# EAGLE design cutdownboard (EAGLE 6.4)
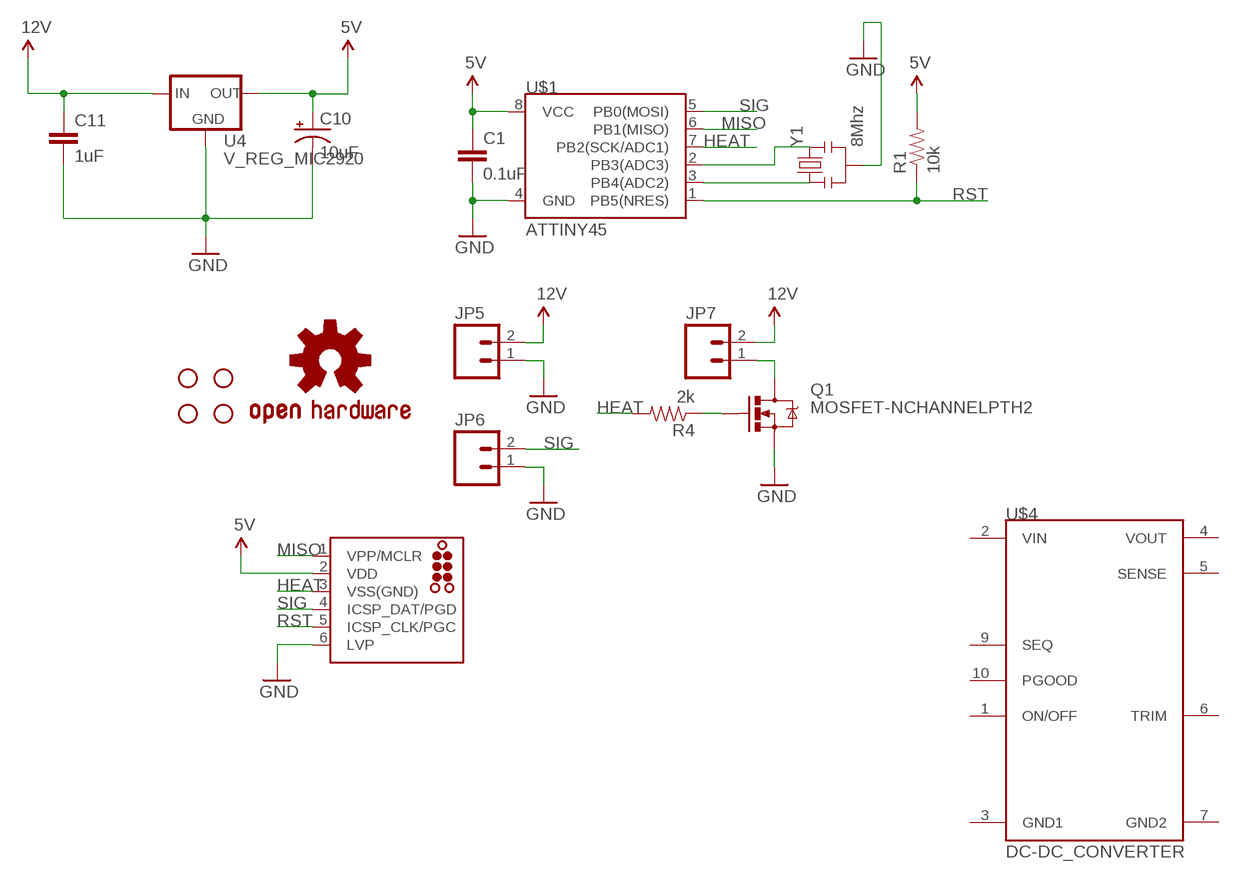
[diagram p0: schematic, sheet 1]

## Parts
C1  0.1uF  C-EUC0603  [C0603]
C10  10uF  CAP_POL1206  [EIA3216]
C11  1uF  C-EUC0603  [C0603]
J1  TC2030-MCP  [TC2030-MCP]
JP1  STAND-OFF  [STAND-OFF]
JP2  STAND-OFF  [STAND-OFF]
JP3  STAND-OFF  [STAND-OFF]
JP4  STAND-OFF  [STAND-OFF]
JP5  M02JST-PTH-2  [JST-2-PTH]
JP6  M02JST-PTH-2  [JST-2-PTH]
JP7  M02JST-PTH-2  [JST-2-PTH]
Q1  MOSFET-NCHANNELPTH2  [TO220V]
R1  10k  RESISTOR0603-RES  [0603-RES]
R4  2k  RESISTOR0603-RES  [0603-RES]
U4  V_REG_MIC2920  [SOT223]
U$1  ATTINY45  [SO08-EIAJ]
U$4  DC-DC_CONVERTER  [DC-DC_CONVERTER]
U$5  OSHW-LOGOS  [OSHW-LOGO-S]
Y1  8Mhz  RESONATORSMD  [RESONATOR-SMD]

## Nets
5V: C1.1 C10.A(+) J1.2(VDD) R1.2 U4.3(OUT) U$1.8(VCC)
GND: C1.2 C10.C(-) C11.2 J1.6(LVP) JP5.1 JP6.1 Q1.3(S) U4.2(GND) U$1.4(GND) Y1.2
HEAT: J1.3(VSS(GND)) R4.2 U$1.7(PB2(SCK/ADC1))
MISO: J1.1(VPP/MCLR) U$1.6(PB1(MISO))
N$1: U$1.3(PB4(ADC2)) Y1.1
N$2: U$1.2(PB3(ADC3)) Y1.3
N$3: JP7.1 Q1.2(D)
N$6: Q1.1(G) R4.1
RST: J1.5(ICSP_CLK/PGC) R1.1 U$1.1(PB5(NRES))
SIG: J1.4(ICSP_DAT/PGD) JP6.2 U$1.5(PB0(MOSI))
VCC: C11.1 JP5.2 JP7.2 U4.1(IN) ; supply symbol labelled 12V
Unconnected: U$4.1(ON/OFF) U$4.2(VIN) U$4.3(GND1) U$4.4(VOUT) U$4.5(SENSE) U$4.6(TRIM) U$4.7(GND2) U$4.9(SEQ) U$4.10(PGOOD)

## Library data of the parts
C1 C11 = rcl:C-EU: CAPACITOR, European symbol
C10 = sparkfun:CAP_POL: Capacitor Polarized These are standard SMD and PTH capacitors. Normally 10uF, 47uF, and 100uF in electrolytic and tantalum varieties. Always verify the external diameter of the through hole cap, it varies with capacity, voltage, and manufacturer. The EIA devices should be standard.
J1 = tag-connect:TC2030: TAG-CONNECT ICSP Connector Manufacturer: Tag-Connect <http://www.tag-connect.com> Cable for easy In-Circuit Serial Programming. Designed for Microchip ICD2, suitable for many others. Two variants - one "with legs" (for hands-free fit on PCB) and another "without legs" for quick programming. PAD Description 1 MCLR/Vpp 2 Vdd 3 GND 4 PGD (ISPDAT) 5 PGC (ISPCLK) 6 nc (used for LVP) ©2009 ROFA.cz - modified and updated by Robert Darlington ‹rdarlington@gmail.com›
JP1-JP4 = sparkfun:STAND-OFF: Stand Off This is the mechanical footprint for a #4 phillips button head screw. Use the keepout ring to avoid running the screw head into surrounding components. SKU : PRT-00447
JP5-JP7 = sparkfun:M02: Header 2 Standard 2-pin 0.1" header. Use with straight break away headers (SKU : PRT-00116), right angle break away headers (PRT-00553), swiss pins (PRT-00743), machine pins (PRT-00117), and female headers (PRT-00115). Molex polarized connector foot print use with SKU : PRT-08233 with associated crimp pins and housings.
Q1 = sparkfun:MOSFET-NCHANNEL
R1 R4 = sparkfun:RESISTOR: Resistor Basic schematic elements and footprints for 0603, 1206, and PTH resistors.
U4 = sparkfun:V_REG_MIC2920: MIC2920A (http://www.micrel.com/_PDF/mic2920.pdf) - 400mA output LDO Regulator
U$1 = sparkfun:ATTINY45: Atmel ATTiny45
U$4 = sparkfun:DC-DC_CONVERTER
U$5 = sparkfun:OSHW-LOGO: Open Source Hardware Logo This logo indicates the piece of hardware it is found on incorporates a OSHW license and/or adheres to the definition of open source hardware found here: http://freedomdefined.org/OSHW
Y1 = sparkfun:RESONATOR: Resonator Small SMD resonator. This is the itty bitty 10/20MHz resonators with built in caps. CSTCE10M0G55 and CSTCE20M0V53. Footprint has been reviewed closely but hasn't been tested yet.

## Board
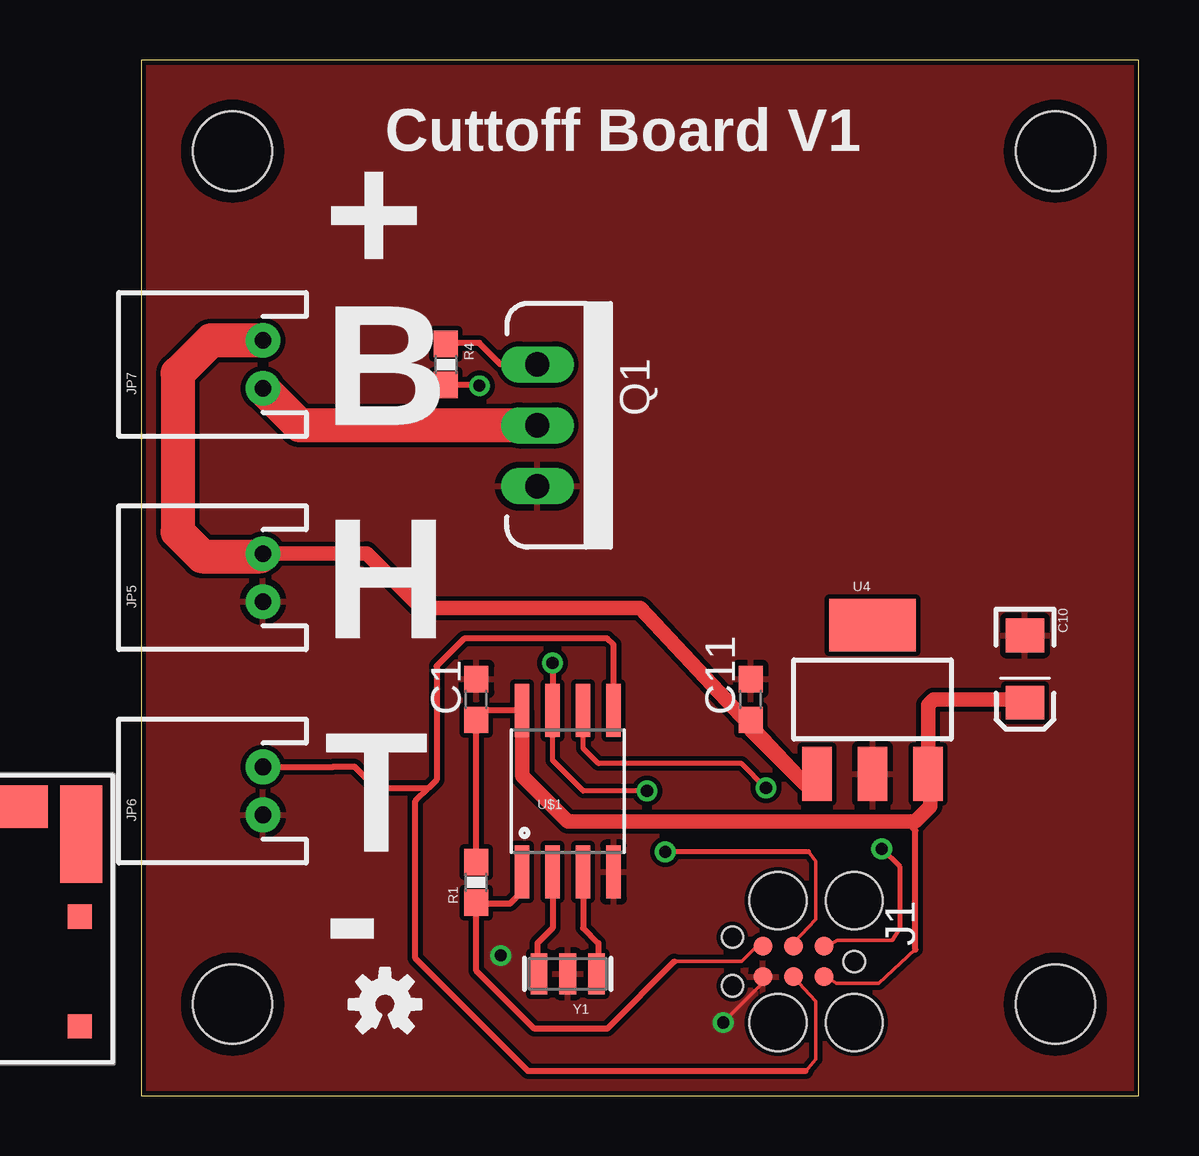
[diagram p1: board, top side]
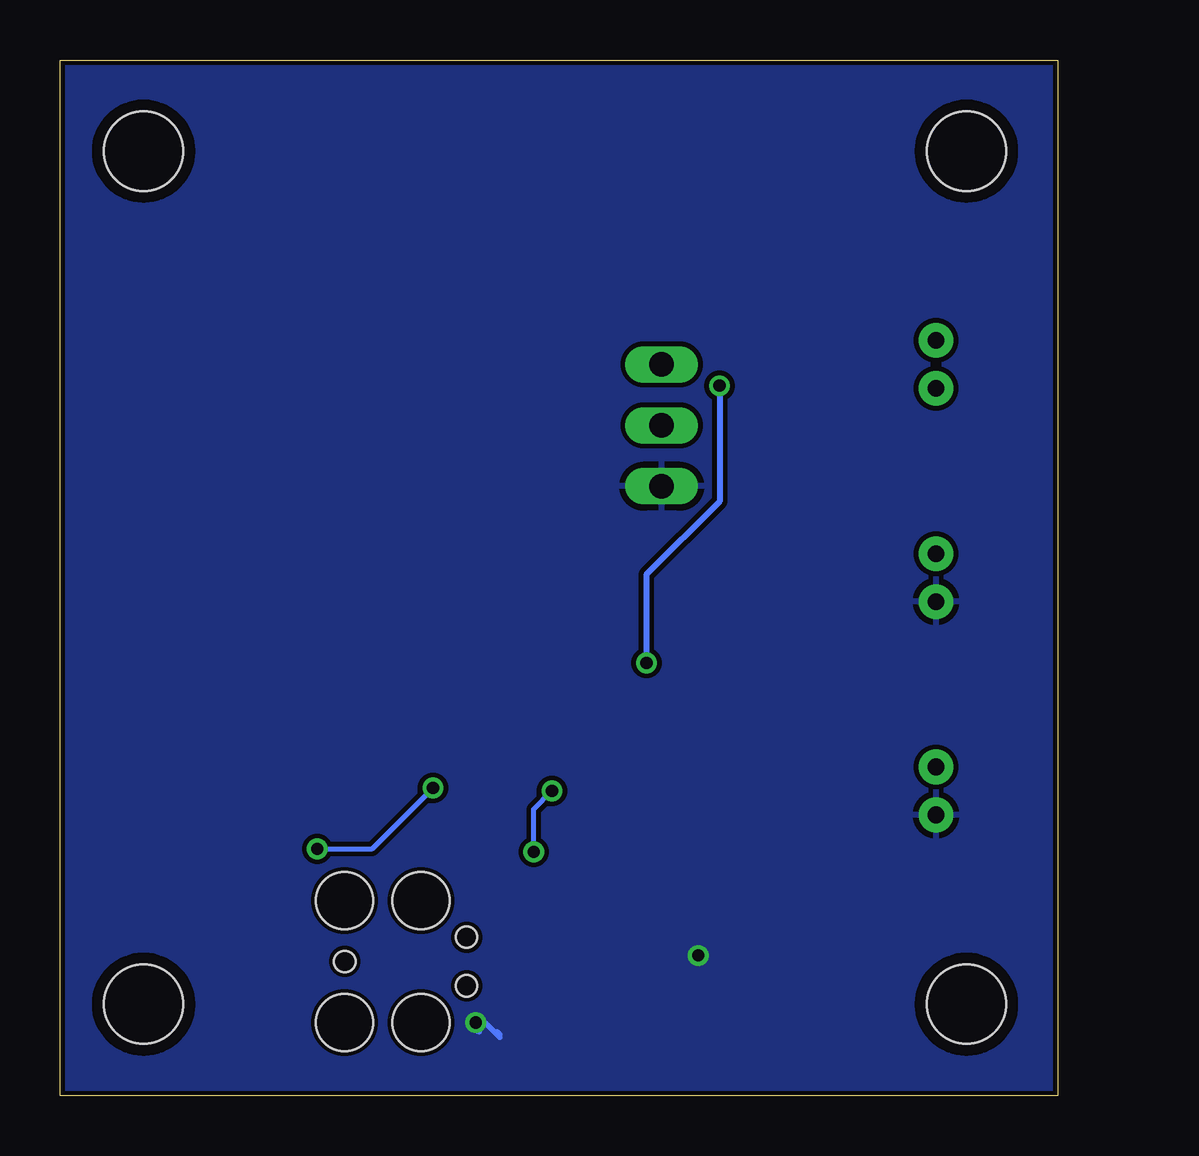
[diagram p2: board, bottom side, seen from below]

Size 41.58 x 43.17 mm. Coordinates in mm from the lower left corner, seen from the top.
Outline: 0,0 41.58,0 41.58,43.17 0,43.17 0,0
Copper layers (1*16): Top 0.0356mm / dielectric 1.5011mm / Bottom 0.0356mm
Design rules "LaenPCBOrder *": minimum track width 6mil, minimum drill 13mil, track to track 6mil, track to pad 6mil, pad to pad 6mil, via to via 6mil, smd to smd 6mil, copper to edge 6mil, drill to drill 6mil, minimum pad ring 7mil, minimum via ring 7mil, stop-mask expansion 4mil, vias tented up to drill 0mil, thermal gap 10mil

### Footprints (pad centres in the part's own frame; a part is rotated, then mirrored left to right if it is on the bottom)
C0603 = smd 1.1 x 1: 1 -0.85,0; 2 0.85,0
EIA3216 = smd 1.4 x 1.6: A 1.4,0; C -1.4,0
TC2030-MCP = smd 0.787 x 0.787: 1 1.27,-0.635; 2 1.27,0.635; 3 2.54,-0.635; 4 2.54,0.635; 5 3.81,-0.635; 6 3.81,0.635 | hole 0.889: 0,0; 5.08,-1.016; 5.08,1.016 | hole 2.375: 0,2.54; 0,-2.54; 3.175,-2.54; 3.175,2.54
STAND-OFF = hole 3.302: 0,0
JST-2-PTH = drill 0.7 pad 1.448: 1 -1,0; 2 1,0
TO220V = drill 1.016 long: 1 -2.54,0; 2 0,0; 3 2.54,0
0603-RES = smd 1.1 x 1: 1 -0.85,0; 2 0.85,0
SOT223 = smd 1.219 x 2.235: 1 -2.311,-3.099; 2 0,-3.099; 3 2.311,-3.099 | smd 3.6 x 2.2: 4 0,3.099
SO08-EIAJ = smd 0.61 x 2.21: 1 -1.905,-3.378; 2 -0.635,-3.378; 3 0.635,-3.378; 4 1.905,-3.378; 5 1.905,3.353; 6 0.635,3.353; 7 -0.635,3.353; 8 -1.905,3.353
DC-DC_CONVERTER = smd 1.01 x 1.01: 1 -4.48,0.1; 5 4.61,0.1; 6 4.61,-4.48; 7 0.1,-4.48; 8 -2.19,-4.48; 9 -4.48,-4.48; 10 -4.48,-2.19 | smd 4.07 x 1.77: 2 -3.33,4.67; 3 1.24,4.67 | smd 1.77 x 4.07: 4 4.67,3.53
RESONATOR-SMD = smd 0.7 x 1.7: 1 -1.2,0; 2 0,0; 3 1.2,0

### Placement (x,y rotation side)
C1  13.97,16.51 90 top
C10  36.83,17.78 270 top
C11  25.4,16.51 90 top
J1  29.72,5.59 180 top
JP1  3.81,39.37 0 top
JP2  3.81,3.81 0 top
JP3  38.1,39.37 0 top
JP4  38.1,3.81 0 top
JP5  5.08,21.59 90 top
JP6  5.08,12.7 90 top
JP7  5.08,30.48 90 top
Q1  16.51,27.94 270 top
R1  13.97,8.89 90 top
R4  12.7,30.48 270 top
U4  30.48,16.51 0 top
U$1  17.78,12.7 0 top
U$4  -7.16,7.37 0 top
U$5  10.16,3.81 0 top
Y1  17.78,5.08 180 top

### Tracks (layer width: path | path; a pad name or v marks a point on that pad's centre or on a via)
5V
  Top 0.152: 28.58,4.95 28.96,4.67 30.73,4.67 32.26,6.1
  Top 0.254: C10.A 36.83,15.88 | R1.2 C1.1 14.36,16.05 U$1.8 | J1.2 28.58,4.95 | 32.26,6.1 32.26,11.05 31.88,11.43
  Top 0.61: C10.A 36.7,16.51 33.02,16.51 32.79,16.28 U4.3 32.89,13.31 32.89,12.07 32.26,11.43 31.88,11.43 17.78,11.43 15.88,13.34 U$1.8
GND  (via drill 0.51)
  Top 0.152: 25.91,4.7 v24.26,3.05
  Top 0.254: J1.6 25.91,4.7
  Bottom 0.203: v24.26,3.05 23.88,3.05 23.24,2.41 23.24,2.54 23.37,2.67
  Bottom 0.254: v24.26,3.05 24.26,2.79 24.13,2.67
  other vias: 14.99,5.84
  pour Bottom (isolate 0.2): 41.91,43.18 0,43.18 0,0 41.91,0
  pour Top (isolate 0.2): 41.91,43.18 0,43.18 0,0 41.91,0
HEAT  (via drill 0.51)
  Top 0.152: 27.18,6.35 28.12,7.34 28.12,9.75 27.81,10.16
  Top 0.203: J1.3 27.18,6.35 | 27.81,10.16 v21.84,10.16 | v21.08,12.7 18.41,12.7 17.15,13.97 U$1.7
  Top 0.254: R4.2 14.06,29.63 v14.1,29.59 | v17.15,18.03 U$1.7
  Bottom 0.203: v21.84,10.16 21.84,11.94 v21.08,12.7
  Bottom 0.254: v14.1,29.59 14.1,24.77 17.15,21.72 v17.15,18.03
MISO  (via drill 0.51)
  Top 0.152: 28.58,6.22 29.01,6.48 31.29,6.48 31.62,6.98
  Top 0.203: J1.1 28.58,6.22 | 31.62,6.98 31.62,9.53 v30.86,10.29 | v26.03,12.83 25.02,13.84 19.05,13.84 18.41,14.48 U$1.6
  Bottom 0.203: v30.86,10.29 28.58,10.29 v26.03,12.83
N$1
  Top 0.254: U$1.3 18.41,6.98 19.05,6.35 19.05,5.15 Y1.1
N$2
  Top 0.254: U$1.2 17.15,6.98 16.51,6.35 16.51,5.15 Y1.3
N$3
  Top 1.422: Q1.2 6.62,27.94 JP7.1
N$6
  Top 0.254: Q1.1 14.99,30.48 14.1,31.37 12.74,31.37 R4.1
RST
  Top 0.152: 25.65,6.22 25.02,5.59 22.23,5.59
  Top 0.254: U$1.1 15.88,8.51 15.37,8 14.01,8 R1.1 13.97,5.21 16.38,2.79 19.43,2.79 22.23,5.59 | J1.5 25.65,6.22
SIG
  Top 0.152: J1.4 28.12,3.94 28.12,1.52 27.69,1.02
  Top 0.254: JP6.2 7.98,13.7 8,13.72 8.89,13.72 9.78,12.83 11.98,12.83 | U$1.5 19.69,18.8 19.43,19.05 13.46,19.05 12.32,17.91 12.32,13.17 11.98,12.83 | 27.69,1.02 16.13,1.02 11.43,5.71 11.43,12.28 11.98,12.83
VCC
  Top 0.254: JP5.2 5.19,22.59 5.21,22.61
  Top 0.61: 5.21,22.61 9.4,22.61 11.68,20.32 20.8,20.32 27.7,12.94 | 27.7,12.94 U4.1 | C11.1 25.4,15.24 27.7,12.94
  Top 1.422: JP7.2 2.91,31.48 1.52,30.1 1.52,23.5 2.54,22.48 4.97,22.48 JP5.2

### Text on the board
tPlace: Cuttoff Board V1 | + | B | H | T | -